# EAGLE design Etapa Control (EAGLE 6.3)
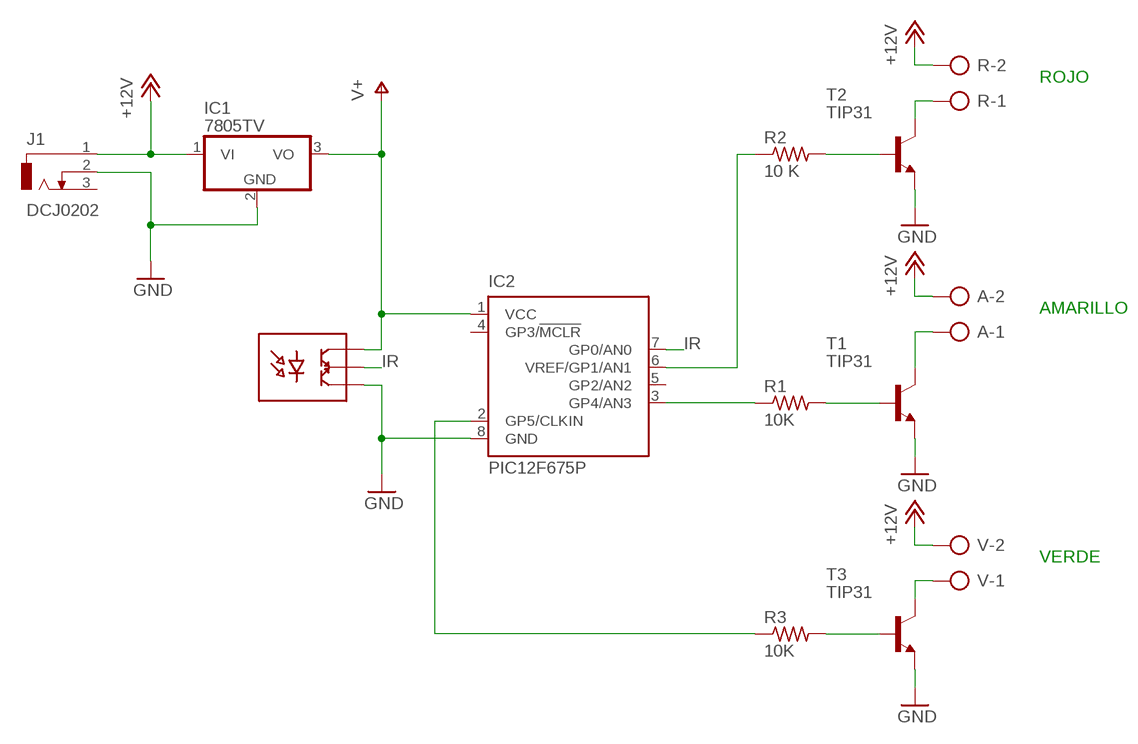
[diagram p0: schematic, sheet 1]

## Parts
A  AK300/2  [AK300/2]
IC1  7805TV  [TO220V]
IC2  PIC12F675P  [DIL8]
J1  DCJ0202  [DCJ0202]
LF1838  LF1838  [LF1838]
R  AK300/2  [AK300/2]
R1  10K  R-US_0204/7  [0204/7]
R2  10 K  R-US_0204/7  [0204/7]
R3  10K  R-US_0204/7  [0204/7]
T1  TIP31  [TO220]
T2  TIP31  [TO220]
T3  TIP31  [TO220]
V  AK300/2  [AK300/2]

## Nets
+12V: A.2 IC1.1(VI) J1.1 R.2 V.2
GND: IC1.2(GND) IC2.8(GND) J1.2 LF1838.GND T1.3(E) T2.3(E) T3.3(E)
IR: IC2.7(GP0/AN0) LF1838.VOUT
N$1: R1.2 T1.1(B)
N$2: R2.2 T2.1(B)
N$3: R3.2 T3.1(B)
N$4: T3.2(C) V.1
N$5: R.1 T2.2(C)
N$6: A.1 T1.2(C)
N$7: IC2.6(VREF/GP1/AN1) R2.1
N$8: IC2.3(GP4/AN3) R1.1
N$9: IC2.2(GP5/CLKIN) R3.1
V+: IC1.3(VO) IC2.1(VCC) LF1838.VCC
Unconnected: IC2.4(GP3/!MCLR) IC2.5(GP2/AN2) J1.3

## Notes on the sheet
- ROJO
- AMARILLO
- VERDE

## Library data of the parts
A R V = con-ptr500:AK300/2: CONNECTOR; OC_FARNELL: unknown; OC_NEWARK: unknown
IC1 = linear:78*: Positive VOLTAGE REGULATOR Source: http://cache.national.com/ds/LM/LM78L05.pdf http://www.fairchildsemi.com/ds/LM/LM7805.pdf
IC2 = microchip:PIC12F675: 8-Pin FLASH-Based 8-Bit CMOS Microcontroller Precision Internal 4 MHz oscillator factory calibrated to ±1% Low Power Features: Standby Current: - 1 nA @ 2.0V, typical Operating Current: - 8.5µA @ 32 kHz, 2.0V, typical - 100µA @ 1 MHz, 2.0V, typical Watchdog Timer Current: - 300 nA @ 2.0V, typical Timer1 oscillator current: - 4µA @ 32 kHz, 2.0V, typical Analog-to-Digital Converter module: - 10-bit resolution - Programmable 4-channel input - Voltage reference input Source: http://www.microchip.com .. 41190E.pdf; MF: MICROCHIP; MPN: PIC12F675-E/P; OC_FARNELL: 9759018; OC_NEWARK: 92C4340
J1 = con-jack:DCJ0202: DC POWER JACK Source: DCJ0202.pdf; OC_FARNELL: unknown; OC_NEWARK: unknown
LF1838 = CustumLib:LF1838
R1-R3 = resistor:R-US_: RESISTOR, American symbol
T1-T3 = transistor:TIP31: NPN Transistor Medium Power Linear Switching Applications Source: http://onsemi.com

## Board
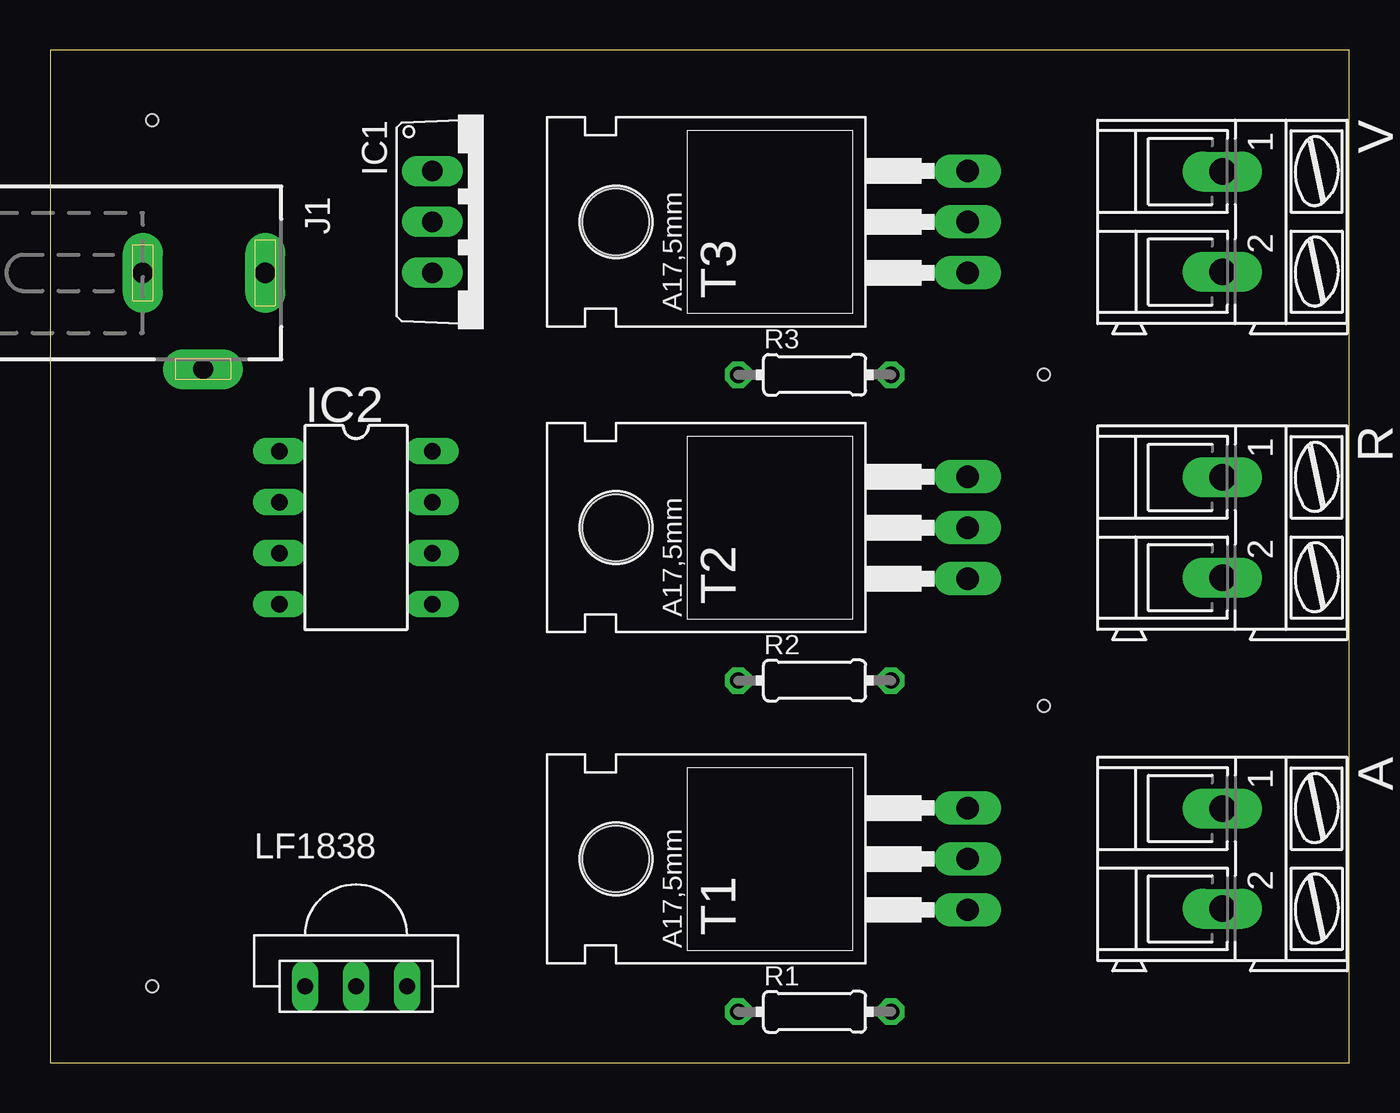
[diagram p1: board, top side]
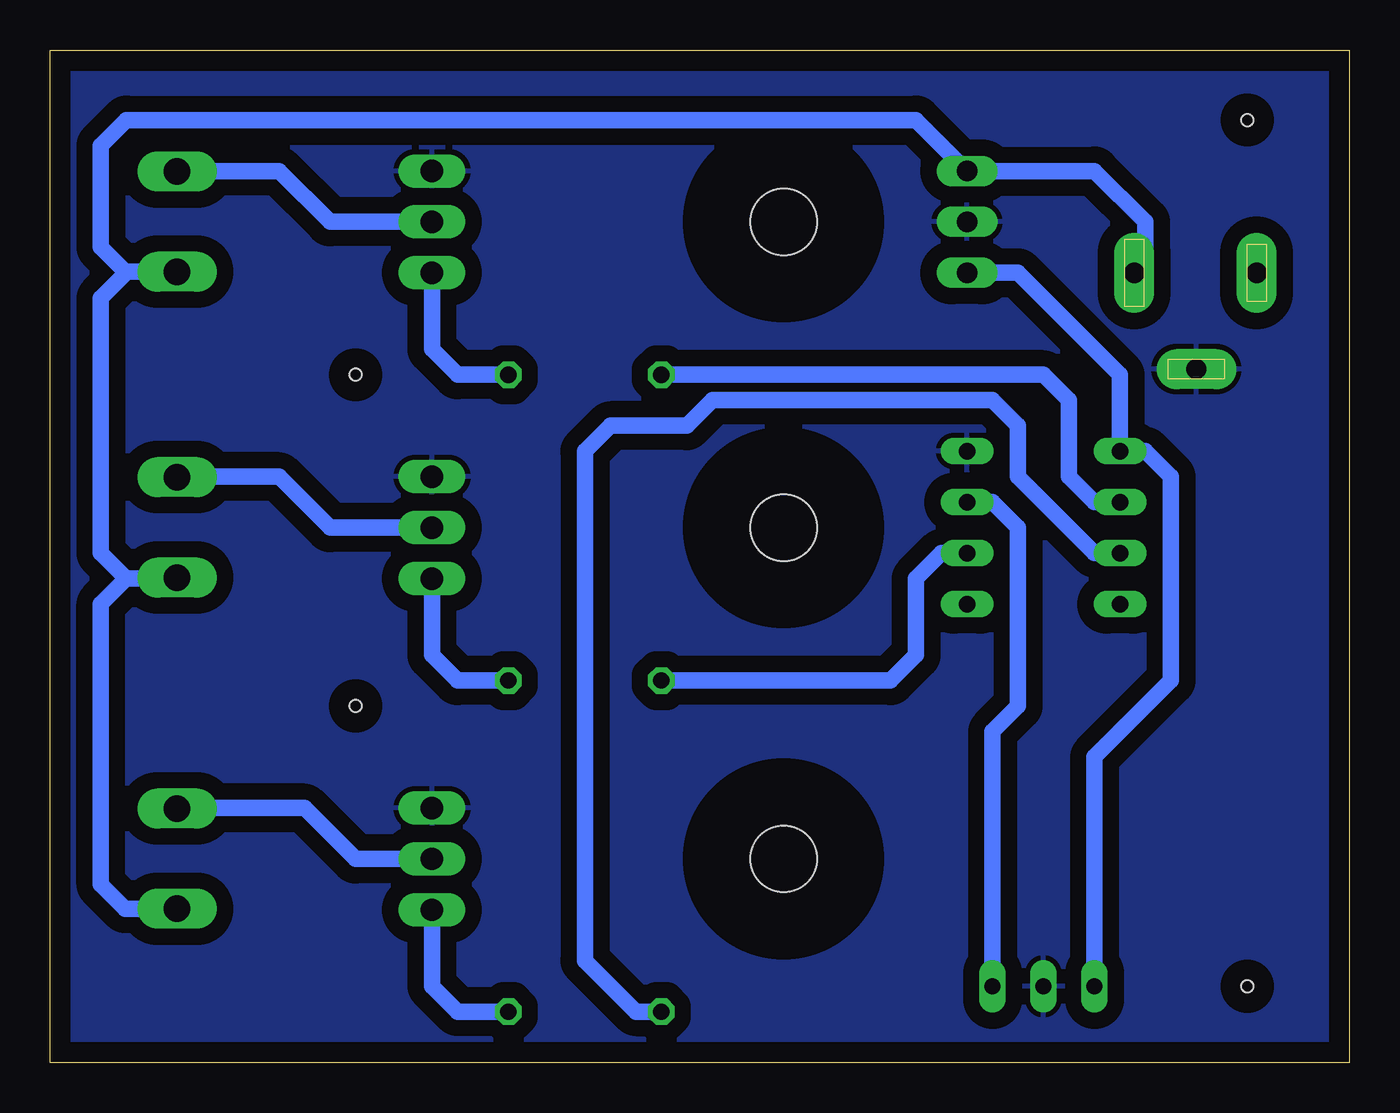
[diagram p2: board, bottom side, seen from below]

Size 64.75 x 50.47 mm. Coordinates in mm from the lower left corner, seen from the top.
Outline: 0,0 64.75,0 64.75,50.47 0,50.47 0,0
Copper layers (1*16): Top 0.035mm / dielectric 1.5mm / Bottom 0.035mm
Design rules "default": minimum track width 10mil, minimum drill 24mil, track to track 8mil, track to pad 8mil, pad to pad 8mil, via to via 8mil, smd to smd 8mil, copper to edge 40mil, drill to drill 8mil, minimum pad ring 10mil, minimum via ring 8mil, stop-mask expansion 4mil, vias tented up to drill 0mil, thermal gap 10mil
Holes 0.6 mm at 5.08,46.99 5.08,3.81 49.53,17.78 49.53,34.29

### Footprints (pad centres in the part's own frame; a part is rotated, then mirrored left to right if it is on the bottom)
AK300/2 = drill 1.321 long: 1 -2.515,0; 2 2.489,0
TO220V = drill 1.016 long: 1 -2.54,-2.54; 2 0,-2.54; 3 2.54,-2.54
DIL8 = drill 0.813 long: 1 -3.81,-3.81; 2 -1.27,-3.81; 3 1.27,-3.81; 4 3.81,-3.81; 5 3.81,3.81; 6 1.27,3.81; 7 -1.27,3.81; 8 -3.81,3.81
DCJ0202 = drill 1 pad 2 long: 1 0,3.1; 2 4.8,0; 3 0,-3
LF1838 = drill 0.8 long: GND 2.54,0; VCC 2.54,-2.54; VOUT 2.54,2.54
0204/7 = drill 0.813 octagon: 1 -3.81,0; 2 3.81,0
TO220 = drill 1.118 long: 1 -2.54,-6.35; 2 0,-6.35; 3 2.54,-6.35 | hole 3.302: 0,11.176

### Placement (x,y rotation side)
A  58.42,10.16 270 top
IC1  21.59,41.91 270 top
IC2  15.24,26.67 270 top
J1  7.62,39.37 270 top
LF1838  15.24,6.35 270 top
R  58.42,26.67 270 top
R1  38.1,2.54 0 top
R2  38.1,19.05 0 top
R3  38.1,34.29 0 top
T1  39.37,10.16 90 top
T2  39.37,26.67 90 top
T3  39.37,41.91 90 top
V  58.42,41.91 270 top

### Tracks (layer width: path | path; a pad name or v marks a point on that pad's centre or on a via)
+12V
  Bottom 0.813: V.2 60.91,39.42 60.96,39.37 | 60.96,39.37 62.23,38.1 62.23,25.4 60.96,24.13 | R.2 58.47,24.13 60.96,24.13 | A.2 61.01,7.67 62.23,8.89 62.23,22.86 60.96,24.13 | 60.96,39.37 62.23,40.64 62.23,45.72 60.96,46.99 21.59,46.99 IC1.1 12.7,44.45 10.16,41.91 10.16,39.93 J1.1
GND
  pour Bottom (isolate 0.813): 0,0 0,50.8 64.77,50.8 64.77,0
IR
  Bottom 0.813: IC2.7 17.78,27.94 16.51,26.67 16.51,17.78 17.78,16.51 LF1838.VOUT
N$1
  Bottom 0.813: R1.2 44.45,2.54 45.72,3.81 T1.1
N$2
  Bottom 0.813: R2.2 44.45,19.05 45.72,20.32 T2.1
N$3
  Bottom 0.813: R3.2 44.45,34.29 45.72,35.56 T3.1
N$4
  Bottom 0.813: T3.2 50.8,41.91 53.34,44.45 58.4,44.45 V.1
N$5
  Bottom 0.813: T2.2 50.8,26.67 53.34,29.21 58.4,29.21 R.1
N$6
  Bottom 0.813: T1.2 49.53,10.16 52.07,12.7 58.4,12.7 A.1
N$7
  Bottom 0.813: R2.1 22.86,19.05 21.59,20.32 21.59,24.13 20.32,25.4 IC2.6
N$8
  Bottom 0.813: IC2.3 12.7,25.4 16.51,29.21 16.51,31.75 17.78,33.02 31.75,33.02 33.02,31.75 36.83,31.75 38.1,30.48 38.1,5.08 35.56,2.54 R1.1
N$9
  Bottom 0.813: IC2.2 12.7,27.94 13.97,29.21 13.97,33.02 15.24,34.29 R3.1
V+
  Bottom 0.813: IC1.3 16.51,39.37 11.43,34.29 IC2.1 10.16,30.48 8.89,29.21 8.89,19.05 12.7,15.24 LF1838.VCC

### Text on the board
Etiquetas: 7805 | Rojo | TIP31 | 10 k | + | 12V | PIC12F675 | TIP31 | Amarillo | 10 k | + | LF1838 | Verde | TIP31 | + | 10 k